# EAGLE design amp-test (EAGLE 9.6.2)
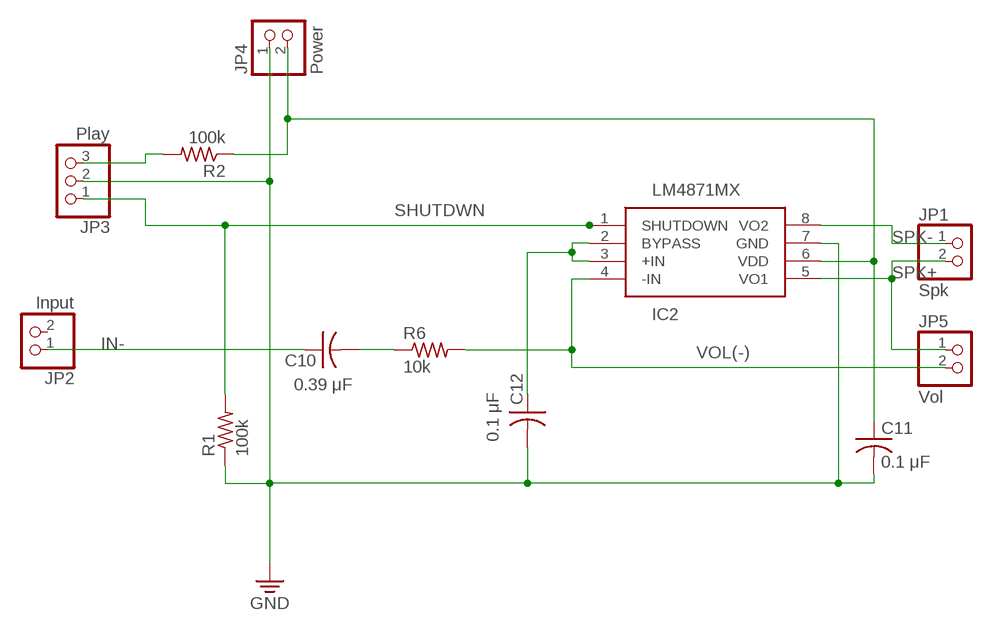
[diagram p0: schematic, sheet 1]

## Parts
C10  0.39 μF  C-USC0805  [C0805]
C11  0.1 μF  C-USC0805  [C0805]
C12  0.1 μF  C-USC0805  [C0805]
IC2  LM4871MX  LM4871MX_NOPB  [SOIC127P600X175-8N]
JP1  Spk  PINHD-1X2  [1X02]
JP2  Input  PINHD-1X2  [1X02]
JP3  Play  PINHD-1X3  [1X03]
JP4  Power  PINHD-1X2  [1X02]
JP5  Vol  PINHD-1X2  [1X02]
R1  100k  R-US_R0805  [R0805]
R2  100k  R-US_R0805  [R0805]
R6  10k  R-US_R0805  [R0805]

## Nets
+5V: C11.1 IC2.6(VDD) JP4.2 R2.1
GND: C11.2 C12.2 IC2.7(GND) JP3.2 JP4.1 R1.1
IN-: C10.1 JP2.1
N$1: JP3.3 R2.2
N$7: C10.2 R6.1
N$9: C12.1 IC2.2(BYPASS) IC2.3(+IN)
SHUTDWN: IC2.1(SHUTDOWN) JP3.1 R1.2
SPK+: IC2.5(VO1) JP1.2 JP5.1
SPK-: IC2.8(VO2) JP1.1
VOL(-): IC2.4(-IN) JP5.2 R6.2
Unconnected: JP2.2

## Library data of the parts
C10-C12 = rcl:C-US: CAPACITOR, American symbol; SPICEPREFIX: C
IC2 = LM4871MX_NOPB:LM4871MX_NOPB: Boomer Series: 3W Audio Amplifier with Shutdown Mode Source: Datasheet <http://www.ti.com/lit/gpn/LM4871>; DESCRIPTION: Boomer Series: 3W Audio Amplifier with Shutdown Mode; HEIGHT: 1.75mm; MANUFACTURER_NAME: Texas Instruments; MANUFACTURER_PART_NUMBER: LM4871MX/NOPB; MOUSER_PART_NUMBER: 926-LM4871MX/NOPB; MOUSER_PRICE-STOCK: https://www.mouser.co.uk/ProductDetail/Texas-Instruments/LM4871MX-NOPB?qs=QbsRYf82W3EZ79z1jrjgtA%3D%3D
JP1 JP2 JP4 JP5 = pinhead:PINHD-1X2: PIN HEADER
JP3 = pinhead:PINHD-1X3: PIN HEADER
R1 R2 R6 = rcl:R-US_: RESISTOR, American symbol; SPICEPREFIX: R

## Board
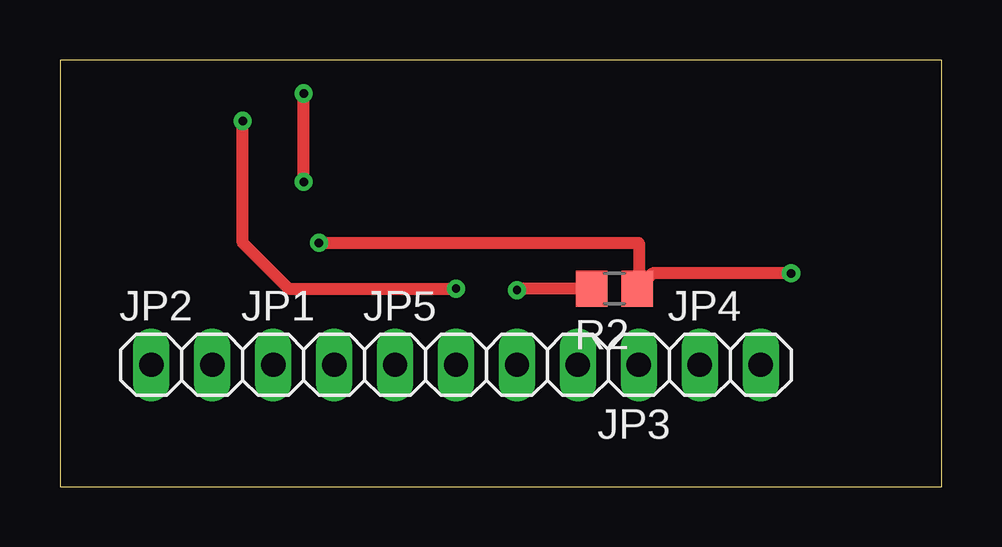
[diagram p1: board, top side]
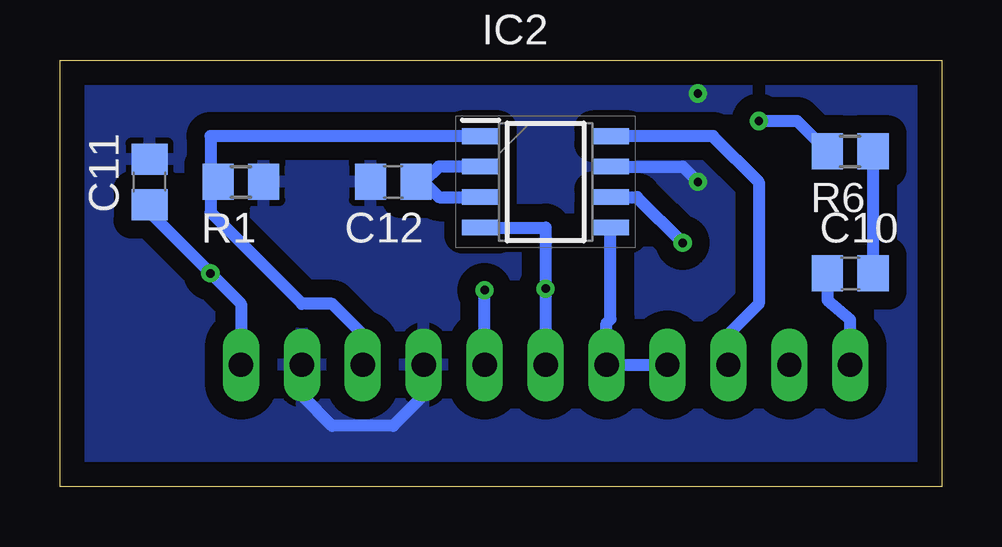
[diagram p2: board, bottom side, seen from below]

Size 36.75 x 17.78 mm. Coordinates in mm from the lower left corner, seen from the top.
Outline: 0,0 36.75,0 36.75,17.78 0,17.78 0,0
Copper layers (1*16): Top 0.035mm / dielectric 1.5mm / Bottom 0.035mm
Design rules "default": minimum track width 6mil, minimum drill 0.35mm, track to track 6mil, track to pad 6mil, pad to pad 6mil, via to via 6mil, smd to smd 6mil, copper to edge 40mil, drill to drill 6mil, minimum pad ring 10mil, minimum via ring 8mil, stop-mask expansion 4mil, vias tented up to drill 0mil, thermal gap 10mil

### Footprints (pad centres in the part's own frame; a part is rotated, then mirrored left to right if it is on the bottom)
C0805 = smd 1.3 x 1.5: 1 -0.95,0; 2 0.95,0
SOIC127P600X175-8N = smd 1.528 x 0.65: 1 -2.711,1.905; 2 -2.711,0.635; 3 -2.711,-0.635; 4 -2.711,-1.905; 5 2.711,-1.905; 6 2.711,-0.635; 7 2.711,0.635; 8 2.711,1.905
1X02 = drill 1.016 long: 1 -1.27,0; 2 1.27,0
1X03 = drill 1.016 long: 1 -2.54,0; 2 0,0; 3 2.54,0
R0805 = smd 1.3 x 1.5: 1 -0.95,0; 2 0.95,0

### Placement (x,y rotation side)
C10  3.81,8.89 0 bottom
C11  33.02,12.7 90 bottom
C12  22.86,12.7 180 bottom
IC2  16.51,12.7 0 bottom
JP1  10.16,5.08 0 top
JP2  5.08,5.08 0 top
JP3  21.59,5.08 180 top
JP4  27.94,5.08 0 top
JP5  15.24,5.08 0 top
R1  29.21,12.7 180 bottom
R2  23.11,8.26 180 top
R6  3.81,13.97 180 bottom

### Tracks (layer width: path | path; a pad name or v marks a point on that pad's centre or on a via)
+5V  (via drill 0.35)
  Top 0.508: v10.79,10.16 24.13,10.16 24.13,8.32 | 24.13,8.32 R2.1 | 24.13,8.32 24.7,8.89 v30.48,8.89
  Bottom 0.508: IC2.6 12.7,12.06 v10.79,10.16 | C11.1 33.02,11.43 v30.48,8.89 29.21,7.62 JP4.2 29.21,3.81
GND  (via drill 0.35)
  Top 0.508: v10.16,12.7 v10.16,16.38
  Bottom 0.508: IC2.7 10.79,13.34 v10.16,12.7 | JP3.2 21.59,3.81 22.86,2.54 25.4,2.54 26.67,3.81 JP4.1
  pour Bottom (isolate 0.745): 0,0 0,17.78 36.83,17.78 36.83,0
IN-
  Bottom 0.508: JP2.1 3.81,6.95 4.76,7.78 C10.1
N$1  (via drill 0.35)
  Top 0.508: R2.2 19.12,8.26 v19.05,8.19
  Bottom 0.508: JP3.3 v19.05,8.19
N$7
  Bottom 0.508: R6.1 C10.2
N$9
  Bottom 0.508: IC2.2 20.95,13.34 21.59,12.7 | 21.59,12.7 20.95,12.06 IC2.3 | 21.59,12.7 C12.1
SHUTDWN
  Bottom 0.508: IC2.1 30.48,14.61 30.48,12.7 | 30.48,12.7 30.48,11.43 26.67,7.62 25.4,7.62 24.13,6.35 JP3.1 | R1.2 30.48,12.7
SPK+
  Bottom 0.508: JP1.2 JP5.1 13.97,6.81 13.8,6.99 IC2.5
SPK-
  Bottom 0.508: JP1.1 8.89,6.35 7.62,7.62 7.62,12.7 9.53,14.61 IC2.8
VOL(-)  (via drill 0.35)
  Top 0.508: v16.51,8.26 9.53,8.26 7.62,10.16 v7.62,15.24
  Bottom 0.508: JP5.2 v16.51,8.26 16.51,10.79 IC2.4 | R6.2 6.03,15.24 v7.62,15.24